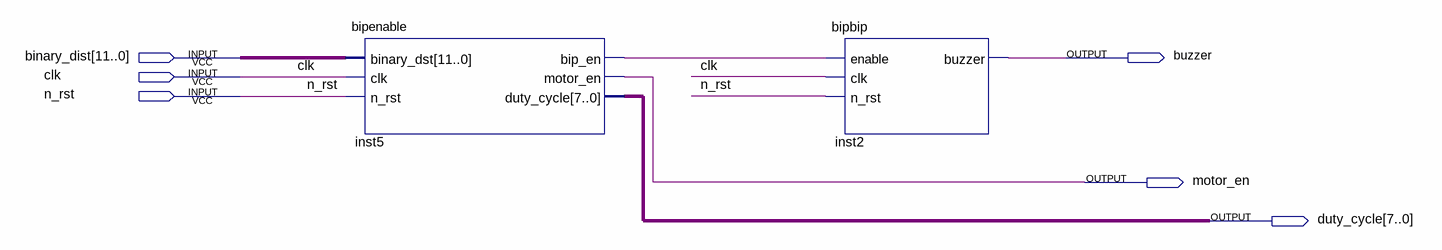
[diagram p0: schematic sheet]
// Quartus schematic bip_interface.bdf as structural Verilog: 2 symbols, 6 pins
module bip_interface (
  input  [11:0] binary_dist,
  input  clk,
  input  n_rst,
  output buzzer,
  output motor_en,
  output [7:0] duty_cycle
);

  wire inst5_bip_en;

  bipenable inst5 (
    .binary_dst(binary_dist), .clk(clk), .n_rst(n_rst), .bip_en(inst5_bip_en), .motor_en(motor_en),
    .duty_cycle(duty_cycle));
  bipbip inst2 (.enable(inst5_bip_en), .clk(clk), .n_rst(n_rst), .buzzer(buzzer));
endmodule
